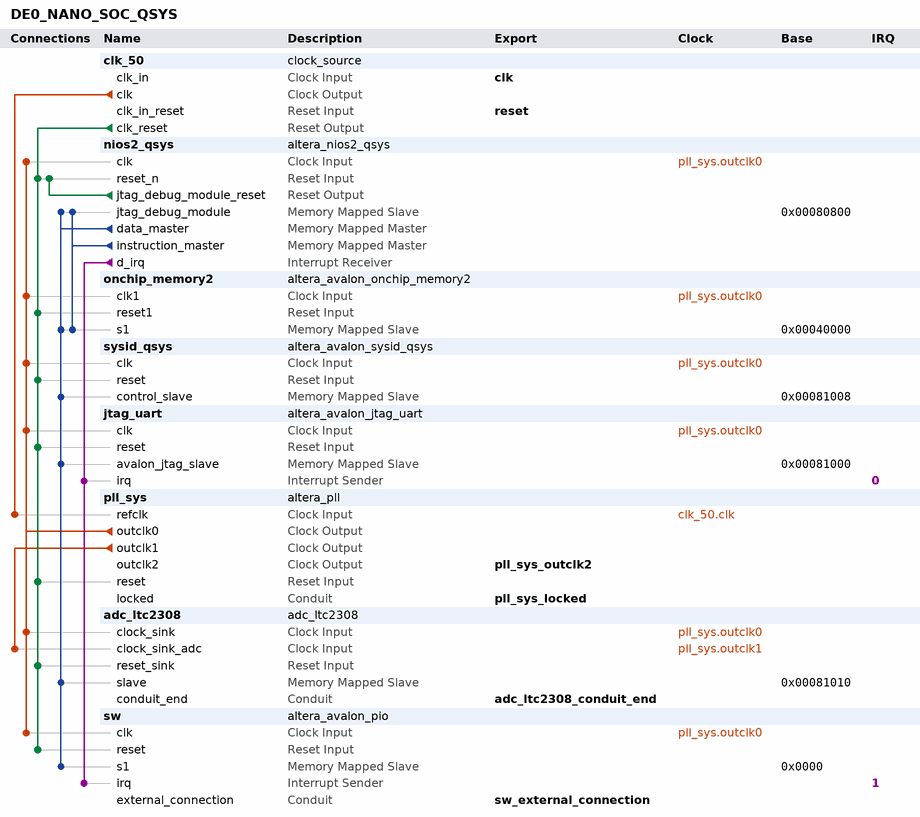
[diagram p0: system contents]
# Platform Designer (Qsys) system DE0_NANO_SOC_QSYS, Cyclone V 5CSEMA6F31C6
# Parameters at their usual value, and those the tool derives, are not listed.
package require -exact qsys 14.0
create_system DE0_NANO_SOC_QSYS
set_project_property DEVICE_FAMILY {Cyclone V}
set_project_property DEVICE 5CSEMA6F31C6

add_instance clk_50 clock_source 14.0
set_instance_parameter_value clk_50 clockFrequency 50000000

add_instance nios2_qsys altera_nios2_qsys 14.0
set_instance_parameter_value nios2_qsys resetrequest_enabled true
set_instance_parameter_value nios2_qsys resetSlave onchip_memory2.s1
set_instance_parameter_value nios2_qsys mmu_TLBMissExcSlave None
set_instance_parameter_value nios2_qsys exceptionSlave onchip_memory2.s1
set_instance_parameter_value nios2_qsys breakSlave nios2_qsys.jtag_debug_module
set_instance_parameter_value nios2_qsys impl Fast
set_instance_parameter_value nios2_qsys icache_size 4096

add_instance onchip_memory2 altera_avalon_onchip_memory2 14.0
set_instance_parameter_value onchip_memory2 dataWidth 32
set_instance_parameter_value onchip_memory2 dualPort false
set_instance_parameter_value onchip_memory2 initMemContent true
set_instance_parameter_value onchip_memory2 initializationFileName onchip_mem.hex
set_instance_parameter_value onchip_memory2 memorySize 160000

add_instance sysid_qsys altera_avalon_sysid_qsys 14.0
set_instance_parameter_value sysid_qsys id 0

add_instance jtag_uart altera_avalon_jtag_uart 14.0
set_instance_parameter_value jtag_uart simInteractiveOptions NO_INTERACTIVE_WINDOWS

add_instance pll_sys altera_pll 14.0
set_instance_parameter_value pll_sys gui_device_speed_grade 2
set_instance_parameter_value pll_sys gui_pll_mode {Integer-N PLL}
set_instance_parameter_value pll_sys gui_reference_clock_frequency 50.0
set_instance_parameter_value pll_sys gui_operation_mode normal
set_instance_parameter_value pll_sys gui_use_locked true
set_instance_parameter_value pll_sys gui_number_of_clocks 3
set_instance_parameter_value pll_sys gui_output_clock_frequency0 100.0
set_instance_parameter_value pll_sys gui_output_clock_frequency1 40.0
set_instance_parameter_value pll_sys gui_output_clock_frequency2 200.0

add_instance adc_ltc2308 adc_ltc2308 1.1

add_instance sw altera_avalon_pio 14.0
set_instance_parameter_value sw captureEdge true
set_instance_parameter_value sw direction Input
set_instance_parameter_value sw edgeType ANY
set_instance_parameter_value sw generateIRQ true
set_instance_parameter_value sw irqType EDGE
set_instance_parameter_value sw width 10

# connections
add_connection clk_50.clk pll_sys.refclk clock
add_connection pll_sys.outclk0 adc_ltc2308.clock_sink clock
add_connection pll_sys.outclk0 jtag_uart.clk clock
add_connection pll_sys.outclk0 nios2_qsys.clk clock
add_connection pll_sys.outclk0 onchip_memory2.clk1 clock
add_connection pll_sys.outclk0 sw.clk clock
add_connection pll_sys.outclk0 sysid_qsys.clk clock
add_connection pll_sys.outclk1 adc_ltc2308.clock_sink_adc clock
add_connection clk_50.clk_reset adc_ltc2308.reset_sink reset
add_connection clk_50.clk_reset jtag_uart.reset reset
add_connection clk_50.clk_reset nios2_qsys.reset_n reset
add_connection clk_50.clk_reset onchip_memory2.reset1 reset
add_connection clk_50.clk_reset pll_sys.reset reset
add_connection clk_50.clk_reset sw.reset reset
add_connection clk_50.clk_reset sysid_qsys.reset reset
add_connection nios2_qsys.jtag_debug_module_reset nios2_qsys.reset_n reset
add_connection nios2_qsys.data_master adc_ltc2308.slave avalon
set_connection_parameter_value nios2_qsys.data_master/adc_ltc2308.slave baseAddress 0x00081010
add_connection nios2_qsys.data_master jtag_uart.avalon_jtag_slave avalon
set_connection_parameter_value nios2_qsys.data_master/jtag_uart.avalon_jtag_slave baseAddress 0x00081000
add_connection nios2_qsys.data_master nios2_qsys.jtag_debug_module avalon
set_connection_parameter_value nios2_qsys.data_master/nios2_qsys.jtag_debug_module baseAddress 0x00080800
add_connection nios2_qsys.data_master onchip_memory2.s1 avalon
set_connection_parameter_value nios2_qsys.data_master/onchip_memory2.s1 baseAddress 0x00040000
add_connection nios2_qsys.data_master sw.s1 avalon
set_connection_parameter_value nios2_qsys.data_master/sw.s1 baseAddress 0x0000
add_connection nios2_qsys.data_master sysid_qsys.control_slave avalon
set_connection_parameter_value nios2_qsys.data_master/sysid_qsys.control_slave baseAddress 0x00081008
add_connection nios2_qsys.instruction_master nios2_qsys.jtag_debug_module avalon
set_connection_parameter_value nios2_qsys.instruction_master/nios2_qsys.jtag_debug_module baseAddress 0x00080800
add_connection nios2_qsys.instruction_master onchip_memory2.s1 avalon
set_connection_parameter_value nios2_qsys.instruction_master/onchip_memory2.s1 baseAddress 0x00040000
add_connection nios2_qsys.d_irq jtag_uart.irq interrupt
set_connection_parameter_value nios2_qsys.d_irq/jtag_uart.irq irqNumber 0
add_connection nios2_qsys.d_irq sw.irq interrupt
set_connection_parameter_value nios2_qsys.d_irq/sw.irq irqNumber 1

# exported interfaces
add_interface clk clock sink
set_interface_property clk EXPORT_OF clk_50.clk_in
add_interface reset reset sink
set_interface_property reset EXPORT_OF clk_50.clk_in_reset
add_interface adc_ltc2308_conduit_end conduit end
set_interface_property adc_ltc2308_conduit_end EXPORT_OF adc_ltc2308.conduit_end
add_interface sw_external_connection conduit end
set_interface_property sw_external_connection EXPORT_OF sw.external_connection
add_interface pll_sys_locked conduit end
set_interface_property pll_sys_locked EXPORT_OF pll_sys.locked
add_interface pll_sys_outclk2 clock source
set_interface_property pll_sys_outclk2 EXPORT_OF pll_sys.outclk2

set_interconnect_requirement {$system} qsys_mm.clockCrossingAdapter HANDSHAKE
set_interconnect_requirement {$system} qsys_mm.maxAdditionalLatency 1

save_system DE0_NANO_SOC_QSYS.qsys
